# EAGLE design pc_ads1292r_brk_v3 (EAGLE 6.6.0)
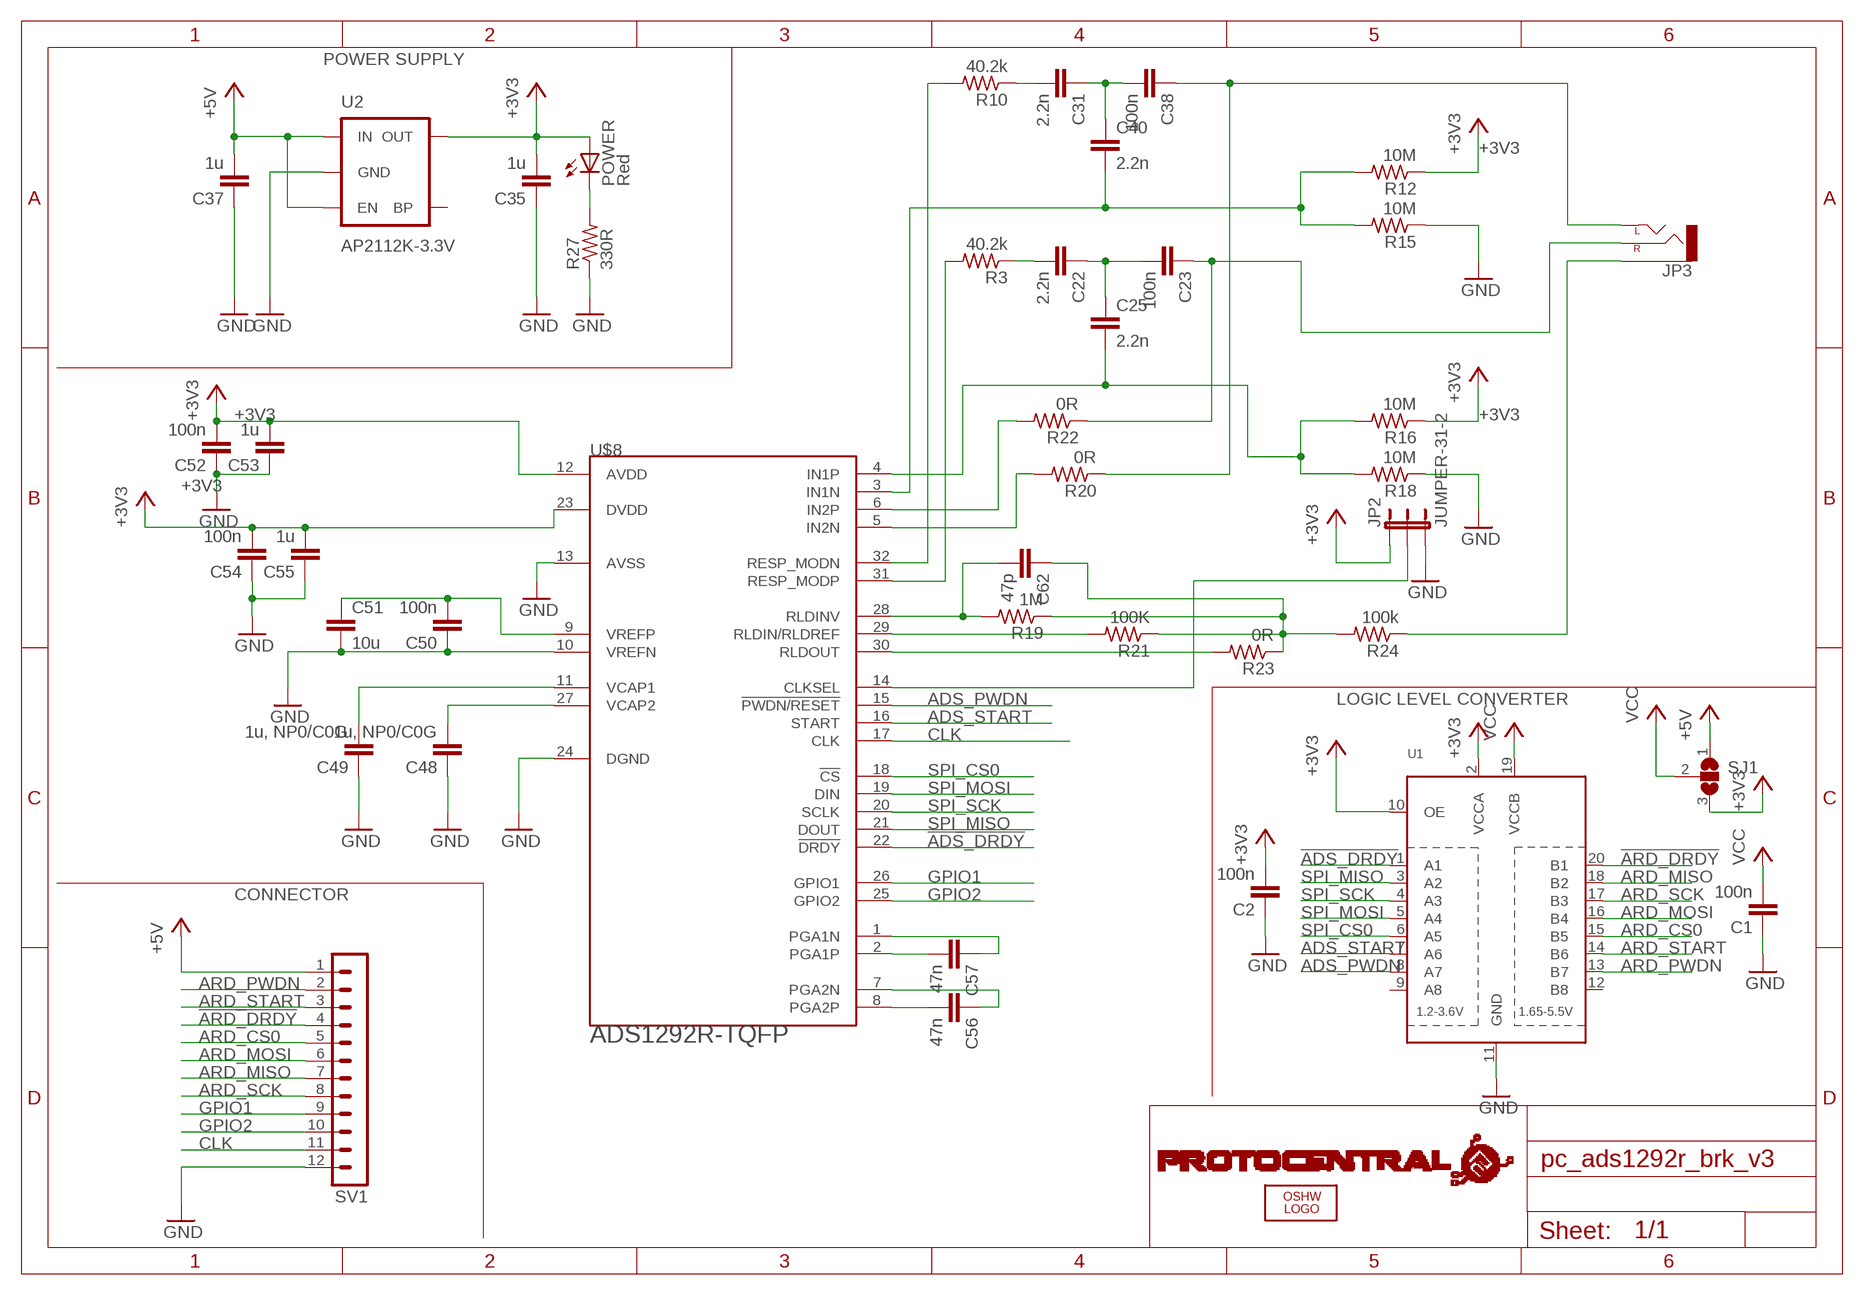
[diagram p0: schematic, sheet 1]

## Parts
C1  100n  C-EUC0402  [C0402]
C2  100n  C-EUC0402  [C0402]
C22  2.2n  C-EUC0402  [C0402]
C23  100n  C-EUC0402  [C0402]
C25  2.2n  C-EUC0402  [C0402]
C31  2.2n  C-EUC0402  [C0402]
C35  1u  C-EUC0402  [C0402]
C37  1u  C-EUC0402  [C0402]
C38  100n  C-EUC0402  [C0402]
C40  2.2n  C-EUC0402  [C0402]
C48  1u, NP0/C0G  C-EUC0402  [C0402]
C49  1u, NP0/C0G  C-EUC0402  [C0402]
C50  100n  C-EUC0402  [C0402]
C51  10u  C-EUC0603  [C0603]
C52  100n  C-EUC0402  [C0402]
C53  1u  C-EUC0402  [C0402]
C54  100n  C-EUC0402  [C0402]
C55  1u  C-EUC0402  [C0402]
C56  47n  C-EUC0402  [C0402]
C57  47n  C-EUC0402  [C0402]
C62  47p  C-EUC0402  [C0402]
JP2  JUMPER-31-2  [SJ_3_PASTE1&2]
JP3  AUDIO-JACKSMD2  [AUDIO-JACK-3.5MM-SMD]
LOGO1  OSHW_LOGO_FILLX0100-NT  [OSHW_FILLX100_NOTEXT]
POWER  Red  LEDCHIPLED_0603  [CHIPLED_0603]
R3  40.2k  R-US_R0402  [R0402]
R10  40.2k  R-US_R0402  [R0402]
R12  10M  R-US_R0402  [R0402]
R15  10M  R-US_R0402  [R0402]
R16  10M  R-US_R0402  [R0402]
R18  10M  R-US_R0402  [R0402]
R19  1M  R-US_R0402  [R0402]
R20  0R  R-US_R0402  [R0402]
R21  100K  R-US_R0402  [R0402]
R22  0R  R-US_R0402  [R0402]
R23  0R  R-US_R0402  [R0402]
R24  100k  R-US_R0402  [R0402]
R27  330R  R-US_R0402  [R0402]
SJ1  SJ2W  [SJ_2]
SV1  MA12-1  [MA12-1]
U1  TXB0108PWR  [TSSOP20]
U2  AP2112K-3.3V  V_REG_LDOSMD  [SOT23-5]
U$1  PROTY-LOGO  [LOGO-PROTY]
U$8  ADS1292R-TQFP  [SQFP-S-5X5-32]

## Nets
!ADS_DRDY: U1.1(A1) U$8.22(!DRDY)
!ARD_DRDY: SV1.4 U1.20(B1)
+3V3: C2.2 C35.2 C52.2 C53.2 C54.2 C55.2 JP2.1 POWER.A R12.1 R16.1 SJ1.3 U1.2(VCCA) U1.10(OE) U2.5(OUT) U$8.12(AVDD) U$8.23(DVDD)
+5V: C37.2 SJ1.1 SV1.1 U2.1(IN) U2.3(EN)
ADS_PWDN: U1.8(A7) U$8.15(!PWDN/RESET)
ADS_START: U1.7(A6) U$8.16(START)
ARD_CS0: SV1.5 U1.15(B5)
ARD_MISO: SV1.7 U1.18(B2)
ARD_MOSI: SV1.6 U1.16(B4)
ARD_PWDN: SV1.2 U1.13(B7)
ARD_SCK: SV1.8 U1.17(B3)
ARD_START: SV1.3 U1.14(B6)
CLK: SV1.11 U$8.17(CLK)
GND: C1.1 C2.1 C35.1 C37.1 C48.1 C49.1 C50.1 C51.2 C52.1 C53.1 C54.1 C55.1 JP2.3 R15.1 R18.1 R27.1 SV1.12 U1.11(GND) U2.2(GND) U$8.10(VREFN) U$8.13(AVSS) U$8.24(DGND)
GPIO1: SV1.9 U$8.26(GPIO1)
GPIO2: SV1.10 U$8.25(GPIO2)
N$7: POWER.C R27.2
N$8: R3.2 U$8.31(RESP_MODP)
N$10: C22.2 R3.1
N$11: C22.1 C23.2 C25.1
N$12: R22.2 U$8.6(IN2P)
N$14: R20.2 U$8.5(IN2N)
N$19: C48.2 U$8.27(VCAP2)
N$26: R10.2 U$8.32(RESP_MODN)
N$28: C31.2 R10.1
N$29: C31.1 C38.2 C40.1
N$30: C38.1 JP3.TIP(LEFT) R20.1
N$31: C40.2 R12.2 R15.2 U$8.3(IN1N)
N$32: C25.2 R16.2 R18.2 U$8.4(IN1P)
N$33: R21.2 U$8.29(RLDIN/RLDREF)
N$34: C62.2 R19.2 U$8.28(RLDINV)
N$35: C62.1 R19.1 R21.1 R23.1 R24.2
N$36: C49.2 U$8.11(VCAP1)
N$37: C56.2 U$8.8(PGA2P)
N$38: C56.1 U$8.7(PGA2N)
N$40: C50.2 C51.1 U$8.9(VREFP)
N$41: C57.2 U$8.2(PGA1P)
N$43: C57.1 U$8.1(PGA1N)
N$45: C23.1 JP3.RING(RIGHT) R22.1
N$50: R23.2 U$8.30(RLDOUT)
N$51: JP3.SLEEVE R24.1
N$104: JP2.2 U$8.14(CLKSEL)
SPI_CS0: U1.6(A5) U$8.18(!CS)
SPI_MISO: U1.3(A2) U$8.21(DOUT)
SPI_MOSI: U1.5(A4) U$8.19(DIN)
SPI_SCK: U1.4(A3) U$8.20(SCLK)
VCC: C1.2 SJ1.2 U1.19(VCCB)
Unconnected: U1.9(A8) U1.12(B8) U2.4(BP)

## Notes on the sheet
- POWER SUPPLY
- LOGIC LEVEL CONVERTER
- CONNECTOR

## Library data of the parts
C1 C2 C22 C23 C25 C31 C35 C37 C38 C40 C48-C50 C52-C57 C62 = rcl:C-EU: CAPACITOR, European symbol
C51 = resistor:C-EU: CAPACITOR, European symbol
JP2 = SparkFun:JUMPER-3
JP3 = SparkFun-Connectors:AUDIO-JACK: 3.5mm Audio Jack Simple 3.5mm common PCB mount audio jack. SKU: PRT-08032; PROD_ID: CONN-10353
LOGO1 = ohw-logo:OSHW_LOGO_FILL
POWER = led:LED: LED OSRAM: - CHIPLED LG R971, LG N971, LY N971, LG Q971, LY Q971, LO R971, LY R971 LH N974, LH R974 LS Q976, LO Q976, LY Q976 LO Q996 - Hyper CHIPLED LW Q18S LB Q993, LB Q99A, LB R99A - SideLED LS A670, LO A670, LY A670, LG A670, LP A670 LB A673, LV A673, LT A673, LW A673 LH A674 LY A675 LS A676, LA A676, LO A676, LY A676, LW A676 LS A679, LY A679, LG A679 - Hyper Micro SIDELED® LS Y876, LA Y876, LO Y876, LY Y876 LT Y87S - SmartLED LW L88C, LW L88S LB L89C, LB L89S, LG L890 LS L89K, LO L89K, LY L89K LS L896, LA L896, LO L896, LY L896 - TOPLED LS T670, LO T670, LY T670, LG T670, LP T670 LSG T670, LSP T670, LSY T670, LOP T670, LYG T670 LG T671, LOG T671, LSG T671 LB T673, LV T673, LT T673, LW T673 LH T674 LS T676, LA T676, LO T676, LY T676, LB T676, LH T676, LSB T676, LW T676 LB T67C, LV T67C, LT T67C, LS T67K, LO T67K, LY T67K, LW E67C LS E67B, LA E67B, LO E67B, LY E67B, LB E67C, LV E67C, LT E67C LW T67C LS T679, LY T679, LG T679 LS T770, LO T770, LY T770, LG T770, LP T770 LB T773, LV T773, LT T773, LW T773 LH T774 LS E675, LA E675, LY E675, LS T675 LS T776, LA T776, LO T776, LY T776, LB T776 LHGB T686 LT T68C, LB T68C - Hyper Mini TOPLED® LB M676 - Mini TOPLED Santana® LG M470 LS M47K, LO M47K, LY M47K Source: http://www.osram.convergy.de LUXEON: - LUMILED® LXK2-PW12-R00, LXK2-PW12-S00, LXK2-PW14-U00, LXK2-PW14-V00 LXK2-PM12-R00, LXK2-PM12-S00, LXK2-PM14-U00 LXK2-PE12-Q00, LXK2-PE12-R00, LXK2-PE12-S00, LXK2-PE14-T00, LXK2-PE14-U00 LXK2-PB12-K00, LXK2-PB12-L00, LXK2-PB12-M00, LXK2-PB14-N00, LXK2-PB14-P00, LXK2-PB14-Q00 LXK2-PR12-L00, LXK2-PR12-M00, LXK2-PR14-Q00, LXK2-PR14-R00 LXK2-PD12-Q00, LXK2-PD12-R00, LXK2-PD12-S00 LXK2-PH12-R00, LXK2-PH12-S00 LXK2-PL12-P00, LXK2-PL12-Q00, LXK2-PL12-R00 Source: www.luxeon.com KINGBRIGHT: KA-3528ASYC Source: www.kingbright.com
R3 R10 R12 R15 R16 R18-R24 R27 = rcl:R-US_: RESISTOR, American symbol
SJ1 = jumper:SJ2W: SMD solder JUMPER
SV1 = con-lstb:MA12-1: PIN HEADER; OC_FARNELL: unknown; OC_NEWARK: unknown
U1 = adafruit:TXB0108PWR: 8-Bit Bi-Directional Level Shifter 1.2V-3.6V (VCCA) to 1.65V-5.5V (VCCB) bi-directional level shifter with auto direction sensing. Max data rate - VCCA 1.8V: 20Mbps (50ns), VCCA 3.3V: 100Mbps (10ns) Digikey: 296-21527-1-ND
U2 = SparkFun-PowerIC:V_REG_LDO: Voltage Regulator LDO Standard 150mA LDO voltage regulator in SOT-23 layout. Micrel part MIC5205. BP (by-pass) pin is used to lower output noise with 470pF cap.; PROD_ID: VREG-12457
U$1 = circuitects:PROTY-LOGO
U$8 = circuitects:ADS1292R-TQFP

## Board
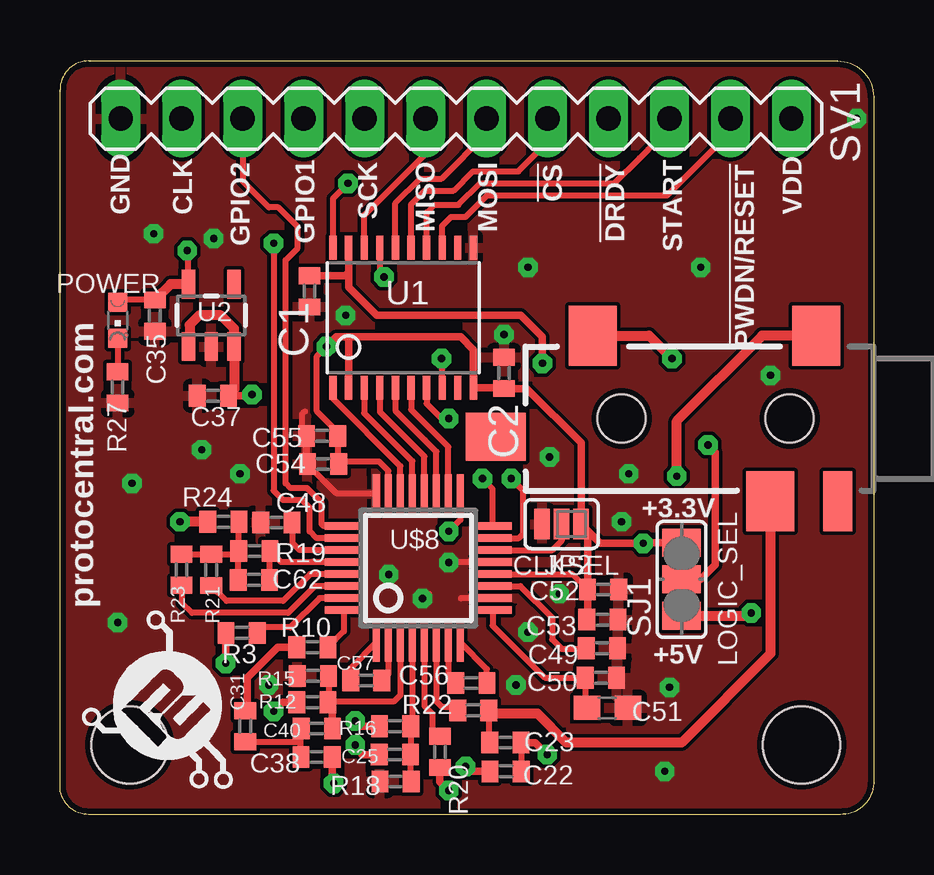
[diagram p1: board, top side]
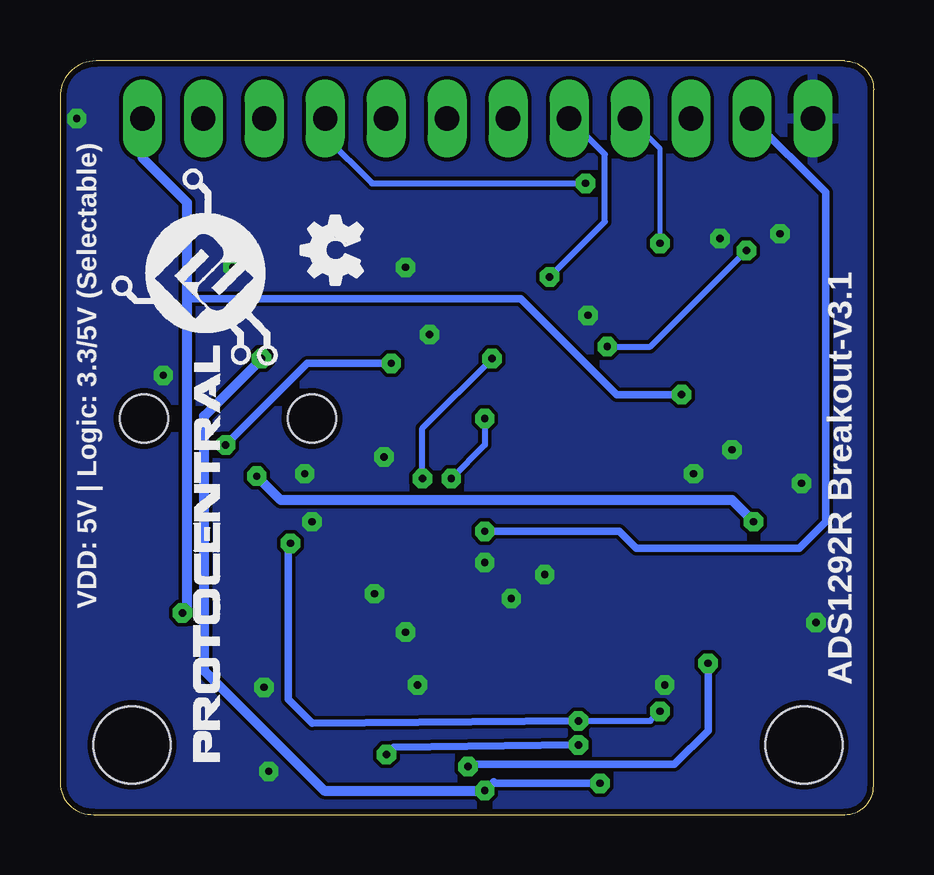
[diagram p2: board, bottom side, seen from below]

Size 33.9 x 31.4 mm. Coordinates in mm from the lower left corner, seen from the top.
Outline: 1.2,31.4 32.4,31.4 arc-90 33.9,29.9 33.9,1.3 arc-90 32.5,0 1.2,0 arc-90 0,1.2 0,30.2 arc-90 1.2,31.4
Copper layers (1*2*15*16): Top 0.035mm / dielectric 1.5mm / Route2 0.035mm / dielectric 0.15mm / Route15 0.035mm / dielectric 0.2mm / Bottom 0.035mm
Design rules "Circuitects-Rules": minimum track width 6mil, minimum drill 0.3mm, track to track 6mil, track to pad 6mil, pad to pad 6mil, via to via 6mil, smd to smd 6mil, copper to edge 10mil, drill to drill 8mil, minimum pad ring 12mil, minimum via ring 10mil, stop-mask expansion 4mil, vias tented up to drill 25mil, thermal gap 10mil
Holes 3.2 mm at 2.9,2.9 30.9,2.9

### Footprints (pad centres in the part's own frame; a part is rotated, then mirrored left to right if it is on the bottom)
C0402 = smd 0.7 x 0.9: 1 -0.65,0; 2 0.65,0
C0603 = smd 1.1 x 1: 1 -0.85,0; 2 0.85,0
SJ_3_PASTE1&2 = smd 0.635 x 1.27: 1 -0.813,0; 2 0,0; 3 0.813,0
AUDIO-JACK-3.5MM-SMD = smd 2 x 2.5: RING 4.3,3.45; SLEEVE 2.4,-3.45; TIP 11.7,-3.45 | smd 1.2 x 2.5: RSH 1.5,3.45 | smd 2.5 x 2: TSH 15.75,0.75 | hole 2: 3.5,0; 10.5,0
CHIPLED_0603 = smd 0.8 x 0.8: A 0,-0.75; C 0,0.75
R0402 = smd 0.7 x 0.9: 1 -0.65,0; 2 0.65,0
SJ_2 = smd 1.168 x 1.6: 1 -1.524,0; 2 0,0; 3 1.524,0
MA12-1 = drill 1.016 long: 1 -13.97,0; 2 -11.43,0; 3 -8.89,0; 4 -6.35,0; 5 -3.81,0; 6 -1.27,0; 7 1.27,0; 8 3.81,0; 9 6.35,0; 10 8.89,0; 11 11.43,0; 12 13.97,0
TSSOP20 = smd 0.305 x 0.991: 1 -2.925,-2.918; 2 -2.275,-2.918; 3 -1.625,-2.918; 4 -0.975,-2.918; 5 -0.325,-2.918; 6 0.325,-2.918; 7 0.975,-2.918; 8 1.625,-2.918; 9 2.275,-2.918; 10 2.925,-2.918; 11 2.925,2.918; 12 2.275,2.918; 13 1.625,2.918; 14 0.975,2.918; 15 0.325,2.918; 16 -0.325,2.918; 17 -0.975,2.918; 18 -1.625,2.918; 19 -2.275,2.918; 20 -2.925,2.918
SOT23-5 = smd 0.55 x 1.2: 1 -0.95,-1.3; 2 0,-1.3; 3 0.95,-1.3; 4 0.95,1.3; 5 -0.95,1.3
SQFP-S-5X5-32 = smd 0.3 x 1.6: 1 -1.75,-3.1; 2 -1.25,-3.1; 3 -0.75,-3.1; 4 -0.25,-3.1; 5 0.25,-3.1; 6 0.75,-3.1; 7 1.25,-3.1; 8 1.75,-3.1; 17 1.75,3.1; 18 1.25,3.1; 19 0.75,3.1; 20 0.25,3.1; 21 -0.25,3.1; 22 -0.75,3.1; 23 -1.25,3.1; 24 -1.75,3.1 | smd 1.6 x 0.3: 9 3.1,-1.75; 10 3.1,-1.25; 11 3.1,-0.75; 12 3.1,-0.25; 13 3.1,0.25; 14 3.1,0.75; 15 3.1,1.25; 16 3.1,1.75; 25 -3.1,1.75; 26 -3.1,1.25; 27 -3.1,0.75; 28 -3.1,0.25; 29 -3.1,-0.25; 30 -3.1,-0.75; 31 -3.1,-1.25; 32 -3.1,-1.75

### Placement (x,y rotation side)
C1  10.4,21.8 90 top
C2  18.5,18.4 270 top
C22  18.57,1.8 180 top
C23  18.56,3 0 top
C25  13.95,2.5 0 top
C31  7.72,3.68 90 top
C35  3.95,20.79 90 top
C37  6.37,17.45 0 top
C38  10.69,2.4 180 top
C40  10.7,3.58 0 top
C48  9.02,12.17 0 top
C49  22.58,6.93 180 top
C50  22.54,5.7 180 top
C51  22.81,4.44 0 top
C52  22.63,9.38 180 top
C53  22.6,8.12 180 top
C54  10.96,14.6 0 top
C55  10.92,15.78 0 top
C56  17.14,5.48 0 top
C57  12.76,5.58 0 top
C62  8.08,9.78 0 top
JP2  20.9,12.1 180 top
JP3  33.9,16.5 180 top
LOGO1  21.3,22.1 90 bottom
POWER  2.4,20.6 180 top
R3  7.57,7.57 0 top
R10  10.52,6.97 0 top
R12  10.52,4.68 0 top
R15  10.54,5.78 0 top
R16  13.96,3.68 0 top
R18  13.98,1.38 0 top
R19  8.1,10.98 0 top
R20  15.83,2.61 90 top
R21  6.3,10.19 270 top
R22  17.22,4.34 180 top
R23  5.06,10.2 270 top
R24  6.81,12.2 0 top
R27  2.4,17.8 90 top
SJ1  25.9,9.8 90 top
SV1  16.5,29 180 top
U1  14.3,20.7 0 top
U2  6.3,20.8 0 top
U$1  7.3,1 90 top
U$2  [PROTY_WITH_TEXT]  25.2,2.2 90 bottom
U$8  14.93,10.27 0 top

### Tracks (layer width: path | path; a pad name or v marks a point on that pad's centre or on a via)
!ADS_DRDY
  Top 0.254: U1.1 11.38,17.32 14.18,14.52 U$8.22
!ARD_DRDY  (via drill 0.3)
  Top 0.254: U1.20 11.38,25.67 v12,26.3
  Bottom 0.254: SV1.4 22.85,28.25 20.9,26.3 v12,26.3
+3V3  (via drill 0.3)
  Top 0.254: C35.2 2.49,21.44 POWER.A | U$8.23 13.68,14.32 13.3,14.7 12.01,14.7 C54.2 11.57,14.64 C55.2 11.57,15.93 10.7,16.8 10.7,19.1 v11.1,19.5 | U$8.12 21.34,10.02 C52.2 | U2.5 5.35,23.45 v5.3,23.5
  Top 0.305: 11.9,19.9 16.7,19.9 17.22,19.38 U1.10 18.47,17.78 C2.2 19.45,17.75 21.71,15.49 JP2.1 | R16.1 12.42,3.68 v12.3,3.9 | SJ1.3 24.32,11.32 v24.3,11.3 22.51,11.3 JP2.1 | U1.2 12.03,19.77 11.9,19.9 | 11.9,19.9 11.5,19.9 v11.1,19.5 | R12.1 9.28,4.68 v8.9,4.3 | JP2.1 21.98,11.83 C52.2 21.98,8.15 C53.2
  Top 0.406: U2.5 4.61,22.1 C35.2
  Bottom 0.254: v12.3,3.9 9.3,3.9 v8.9,4.3 | v11.1,19.5 9.3,19.5 v5.3,23.5
  Bottom 0.305: v12.3,3.9 23.4,3.8 24.4,4.8 24.4,11.2 v24.3,11.3
+5V  (via drill 0.3)
  Top 0.305: C37.2 7.95,17.45 v8,17.5
  Top 0.406: SJ1.1 28.68,8.28 v28.8,8.4 | U2.1 5.4,19.55 5.4,20.4 5.8,20.8 6.7,20.8 7.25,20.25 U2.3 7.25,17.68 C37.2
  Bottom 0.305: 28.6,21.6 28.5,21.5 14.7,21.5 10.7,17.5 v8,17.5
  Bottom 0.406: v28.8,8.4 28.6,8.6 28.6,21.6 28.6,25.5 30.47,27.37 SV1.1
ADS_PWDN  (via drill 0.3)
  Top 0.254: U1.8 15.92,18.97 v15.9,19 | U$8.15 19.12,11.52 19.3,11.7 19.3,13.5 v18.8,14
  Bottom 0.254: v18.8,14 18.8,16.1 v15.9,19
ADS_START  (via drill 0.3)
  Top 0.254: U1.7 15.28,17.12 15.9,16.5 v16.2,16.5 | U$8.16 18.03,13.57 v17.6,14
  Bottom 0.254: v16.2,16.5 16.2,15.4 v17.6,14
ARD_CS0
  Top 0.254: U1.15 14.62,25.42 15.2,26 16.4,26 17.2,26.8 19.1,26.8 20.31,28.01 SV1.5
ARD_MISO
  Top 0.254: U1.18 12.68,24.97 15.23,27.53 SV1.7
ARD_MOSI
  Top 0.254: U1.16 13.97,25.47 15,26.5 15.9,26.5 17.77,28.37 SV1.6
ARD_PWDN
  Top 0.254: U1.13 15.92,24.52 16.3,24.9 16.9,24.9 17.8,25.8 25.3,25.8 26.9,27.4 27.1,27.6 27.93,28.43 SV1.2
ARD_SCK  (via drill 0.3)
  Top 0.254: U1.17 13.33,22.57 v13.5,22.4
  Bottom 0.254: v13.5,22.4 11.2,24.7 11.2,27.51 SV1.8
ARD_START
  Top 0.254: U1.14 15.28,25.07 15.6,25.4 16.6,25.4 17.5,26.3 23.1,26.3 24.15,27.35 24.5,27.7 25.39,28.59 SV1.3
CLK  (via drill 0.3)
  Top 0.254: U$8.17 16.68,12.28 v16.2,11.8
  Bottom 0.305: SV1.11 2,25.93 2,12.2 3.1,11.1 9.9,11.1 10.6,11.8 v16.2,11.8
GND  (via drill 0.3)
  Top 0.2: v15.1,9 15.2,9 15.4,9.2
  Top 0.254: U$8.24 11.54,13.37 C54.1 | C55.1 10.27,15.83 10.1,16 10.1,16.7 10.2,16.8 | U$8.13 16.22,10.52 v16.2,10.5 | U$8.10 16.72,9.02 16.7,9
  Top 0.305: C55.1 10.27,14.64 C54.1
  other vias: 20.4,14.9 5.9,15.2 19,5.4 23.4,12.2 29.6,18.3 26.7,22.8 2.4,8 3,13.8 3.9,24.2 6.4,24 8.7,5.4 20.8,9.2 19.5,7.6 25.4,5.3 7.5,14.2 23.7,14.2 25.2,1.8 19.5,22.8 33.2,29 13.7,10 11.9,20.8 18.5,20
  pour Top: -0.5,31.9 34.3,32.3 34.1,-0.1 -0.1,-0.1
  pour Bottom: -0.5,31.8 34.1,32.5 33.9,-0.2 -0.3,-0.2
GPIO1  (via drill 0.3)
  Top 0.254: U$8.26 10.68,11.52 10.4,11.8 10.4,12.8 10.1,13.1 9.3,13.1 8.9,13.5 v8.9,23.8
  Bottom 0.2: v8.9,23.8 8.9,27.75 SV1.9
GPIO2
  Top 0.254: U$8.25 10.98,12.02 10.9,12.1 10.9,13 10.3,13.6 9.6,13.6 9.4,13.8 9.4,23.1 9.9,23.6 9.9,24.5 9.1,25.3 8.7,25.3 7.61,26.39 SV1.10
N$7
  Top 0.254: POWER.C R27.2
N$8
  Top 0.254: U$8.31 10.82,9.02 9.6,7.8 8.45,7.8 R3.2
N$10  (via drill 0.3)
  Top 0.305: C22.2 17.1,1.8 v16.9,2 | v6.9,6.3 6.9,7.55 R3.1
  Bottom 0.305: v6.9,6.3 6.9,3.5 8.3,2.1 16.8,2.1 v16.9,2
N$11  (via drill 0.3)
  Top 0.254: C23.2 C22.1
  Top 0.305: C23.2 19.8,3 v20.3,2.5 | C25.1 12.6,2.5 v12.3,2.9
  Bottom 0.305: v12.3,2.9 20,2.8 v20.3,2.5
N$12
  Top 0.254: U$8.6 15.68,4.72 15.9,4.5 16.41,4.5 R22.2
N$14
  Top 0.254: U$8.5 15.18,4.52 15.5,4.2 15.5,3.59 R20.2
N$19
  Top 0.254: U$8.27 9.98,11.02 9.7,11.3 9.7,12.14 C48.2
N$26
  Top 0.254: U$8.32 11.83,7.63 R10.2
N$28
  Top 0.305: C31.2 7.8,4.41 7.8,5.7 9.07,6.97 R10.1
N$29
  Top 0.254: C31.1 9.9,3.03 C40.1 9.95,2.09 C38.2
N$30  (via drill 0.3)
  Top 0.305: C38.1 11.34,1.36 v11.4,1.3 | R20.1 15.83,1.37 v16.2,1
  Top 0.406: JP3.TIP 24.55,19.95 v25.5,19
  Bottom 0.305: v11.4,1.3 15.76,1.3 15.83,1.37 v16.2,1
  Bottom 0.406: v25.5,19 27.9,16.6 27.9,6 22.9,1 v16.2,1
N$31
  Top 0.254: U$8.3 14.18,4.98 13.9,4.7 11.19,4.7 | R15.2 11.19,4.7 | 11.19,4.7 R12.2
  Top 0.305: C40.2 11.35,4.66 R12.2
N$32
  Top 0.254: U$8.4 14.68,3.75 R16.2 C25.2 14.6,1.41 R18.2
N$33
  Top 0.254: U$8.29 10.42,10.02 9.3,8.9 6.94,8.9 R21.2
N$34
  Top 0.254: C62.2 8.73,11.06 R19.2 9.21,10.52 U$8.28
N$35
  Top 0.254: R19.1 7.45,12.29 R24.2 | C62.1 7.43,10.96 R19.1 | R19.1 7.31,10.84 R21.1 R23.1
N$36
  Top 0.254: U$8.11 19.18,9.52 20.5,8.2 20.5,7.3 20.9,6.9 21.9,6.9 C49.2
N$37
  Top 0.254: C56.2 17.79,6.06 U$8.8
N$38
  Top 0.254: U$8.7 16.18,5.79 C56.1
N$40
  Top 0.254: U$8.9 18.03,7.87 20.2,5.7 C50.2 21.89,4.51 C51.1
N$41
  Top 0.254: U$8.2 13.68,5.85 C57.2
N$43
  Top 0.254: C57.1 12.11,6.1 U$8.1
N$45
  Top 0.254: R22.1 17.87,3.04 C23.1
  Top 0.406: JP3.RING 29.6,6.7 25.9,3 21.1,3 19.9,4.2 17.91,4.2 R22.1
N$50
  Top 0.254: U$8.30 10.62,9.52 9.5,8.4 5.5,8.4 5.1,8.8 5.1,9.51 R23.2
N$51  (via drill 0.3)
  Top 0.406: R24.1 v5,12.2 | JP3.SLEEVE 29.25,19.95 25.7,16.4 v25.7,14.1
  Bottom 0.406: v5,12.2 5.9,13.1 24.7,13.1 v25.7,14.1
N$104
  Top 0.254: U$8.14 20.52,11.02 20.9,11.4 JP2.2
SPI_CS0
  Top 0.254: U1.6 14.62,16.88 15.8,15.7 15.9,15.6 16.18,15.32 U$8.18
SPI_MISO
  Top 0.254: U1.3 12.68,16.72 14.68,14.72 U$8.21
SPI_MOSI
  Top 0.254: U1.5 13.97,16.82 15.05,15.75 15.2,15.6 15.68,15.12 U$8.19
SPI_SCK
  Top 0.254: U1.4 13.33,16.77 15.18,14.92 U$8.20
VCC  (via drill 0.3)
  Top 0.305: U1.19 12.03,22.6 | 12.03,22.6 12.03,21.97 13.2,20.8 19.2,20.8 20.1,19.9 v20.1,18.8 | SJ1.2 26.7,9.8 27.3,10.4 27.3,15.1 v27,15.4 | C1.2 11.88,22.45 12.03,22.6
  Bottom 0.305: v20.1,18.8 23.6,18.8 v27,15.4

### Text on the board
tPlace: SCK | MISO | MOSI | !CS | !DRDY | START | !PWDN/RESET | GND | CLK | VDD | GPIO2 | GPIO1 | +3.3V | LOGIC_SEL | CLKSEL | protocentral.com | +5V
bPlace: VDD: 5V | Logic: 3.3/5V (Selectable) | ADS1292R Breakout-v3.1